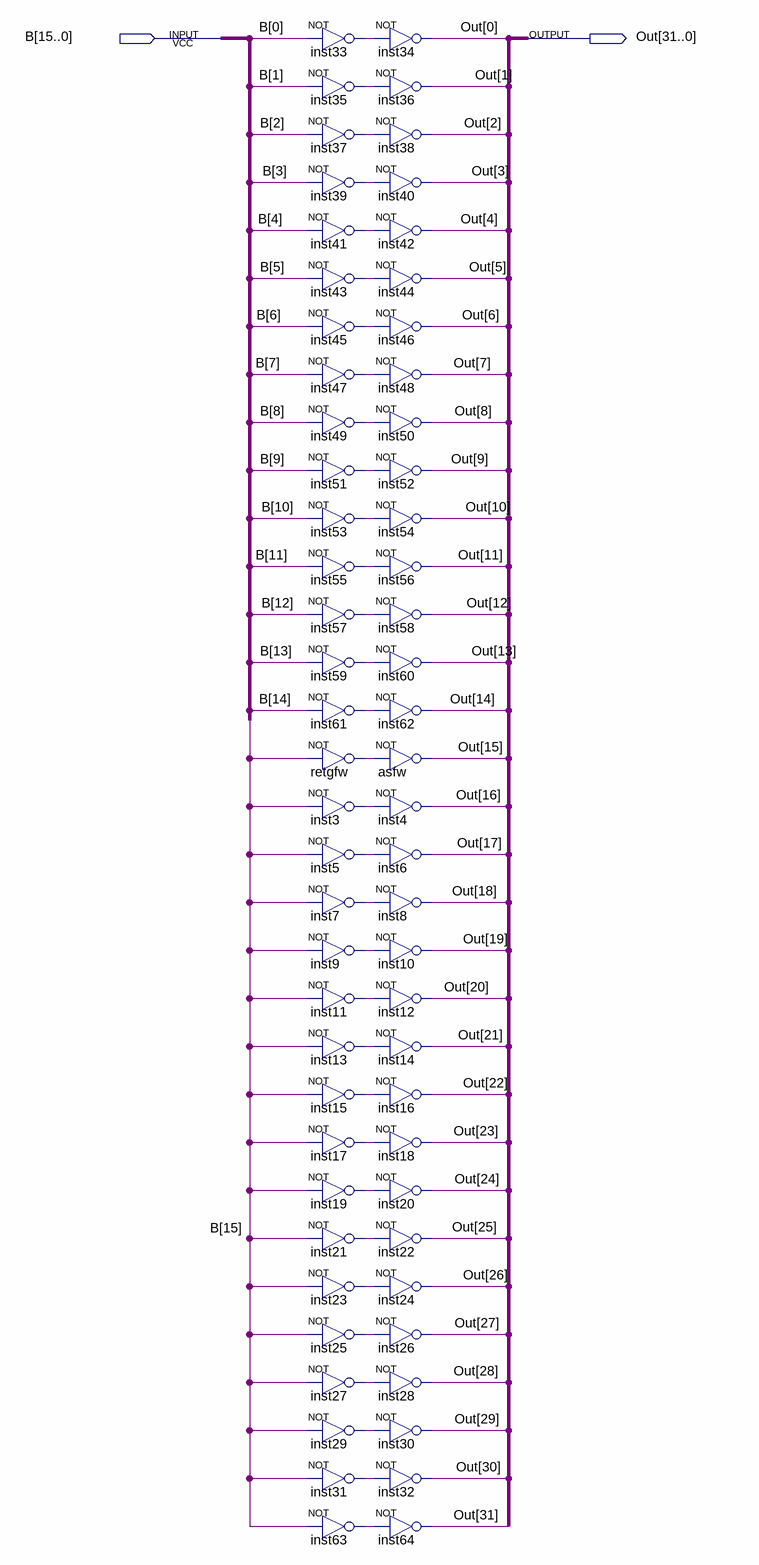
[diagram p0: schematic sheet]
// Quartus schematic ExtensaoSinal.bdf as structural Verilog: 64 symbols, 2 pins
module ExtensaoSinal (
  input  [15:0] B,
  output [31:0] Out
);

  wire inst3_out, inst5_out, inst7_out, inst9_out, inst11_out, inst13_out, inst15_out, inst17_out,
       inst19_out, inst21_out, inst23_out, inst25_out, inst27_out, inst29_out, inst31_out, inst33_out,
       inst35_out, inst37_out, inst39_out, inst41_out, inst43_out, inst45_out, inst47_out, inst49_out,
       inst51_out, inst53_out, inst55_out, inst57_out, inst59_out, inst61_out, inst63_out, retgfw_out;

  not inst33 (inst33_out, B[0]);
  not inst35 (inst35_out, B[1]);
  not inst37 (inst37_out, B[2]);
  not inst39 (inst39_out, B[3]);
  not inst41 (inst41_out, B[4]);
  not inst43 (inst43_out, B[5]);
  not inst45 (inst45_out, B[6]);
  not inst47 (inst47_out, B[7]);
  not inst49 (inst49_out, B[8]);
  not inst51 (inst51_out, B[9]);
  not inst53 (inst53_out, B[10]);
  not inst55 (inst55_out, B[11]);
  not inst57 (inst57_out, B[12]);
  not inst59 (inst59_out, B[13]);
  not inst61 (inst61_out, B[14]);
  not retgfw (retgfw_out, B[15]);
  not inst3 (inst3_out, B[15]);
  not inst5 (inst5_out, B[15]);
  not inst7 (inst7_out, B[15]);
  not inst9 (inst9_out, B[15]);
  not inst11 (inst11_out, B[15]);
  not inst13 (inst13_out, B[15]);
  not inst15 (inst15_out, B[15]);
  not inst17 (inst17_out, B[15]);
  not inst19 (inst19_out, B[15]);
  not inst21 (inst21_out, B[15]);
  not inst23 (inst23_out, B[15]);
  not inst25 (inst25_out, B[15]);
  not inst27 (inst27_out, B[15]);
  not inst29 (inst29_out, B[15]);
  not inst31 (inst31_out, B[15]);
  not inst63 (inst63_out, B[15]);
  not inst34 (Out[0], inst33_out);
  not inst36 (Out[1], inst35_out);
  not inst38 (Out[2], inst37_out);
  not inst40 (Out[3], inst39_out);
  not inst42 (Out[4], inst41_out);
  not inst44 (Out[5], inst43_out);
  not inst46 (Out[6], inst45_out);
  not inst48 (Out[7], inst47_out);
  not inst50 (Out[8], inst49_out);
  not inst52 (Out[9], inst51_out);
  not inst54 (Out[10], inst53_out);
  not inst56 (Out[11], inst55_out);
  not inst58 (Out[12], inst57_out);
  not inst60 (Out[13], inst59_out);
  not inst62 (Out[14], inst61_out);
  not asfw (Out[15], retgfw_out);
  not inst4 (Out[16], inst3_out);
  not inst6 (Out[17], inst5_out);
  not inst8 (Out[18], inst7_out);
  not inst10 (Out[19], inst9_out);
  not inst12 (Out[20], inst11_out);
  not inst14 (Out[21], inst13_out);
  not inst16 (Out[22], inst15_out);
  not inst18 (Out[23], inst17_out);
  not inst20 (Out[24], inst19_out);
  not inst22 (Out[25], inst21_out);
  not inst24 (Out[26], inst23_out);
  not inst26 (Out[27], inst25_out);
  not inst28 (Out[28], inst27_out);
  not inst30 (Out[29], inst29_out);
  not inst32 (Out[30], inst31_out);
  not inst64 (Out[31], inst63_out);
endmodule
